# EAGLE design Impedance-Test-PCB (EAGLE 9.5.0)
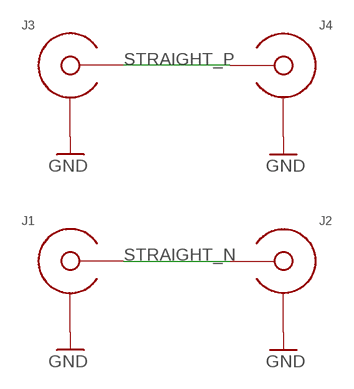
[diagram p0: schematic, sheet 1]

## Parts
J1  SMA-EDGE-LAUNCH4020N4  [SMA-EDGE-LAUNCH-4L-4020-N4]
J2  SMA-EDGE-LAUNCH4020N4  [SMA-EDGE-LAUNCH-4L-4020-N4]
J3  SMA-EDGE-LAUNCH4020N4  [SMA-EDGE-LAUNCH-4L-4020-N4]
J4  SMA-EDGE-LAUNCH4020N4  [SMA-EDGE-LAUNCH-4L-4020-N4]

## Nets
GND: J1.BOTTOM_GND(SHIELD) J1.GND@1(SHIELD) J1.GND@2(SHIELD) J1.GND@3(SHIELD) J1.GND@4(SHIELD) J1.GND@5(SHIELD) J1.GND@6(SHIELD) J1.GND@7(SHIELD) J1.GND@8(SHIELD) J1.GND@9(SHIELD) J1.GND@10(SHIELD) J1.GND@14(SHIELD) J1.GND@15(SHIELD) J1.GND@16(SHIELD) J1.GND@17(SHIELD) J1.GND_PAD1(SHIELD) J1.GND_PAD2(SHIELD) J1.P$1(SHIELD) J1.P$2(SHIELD) J1.P$3(SHIELD) J1.P$4(SHIELD) J1.P$5(SHIELD) J2.BOTTOM_GND(SHIELD) J2.GND@1(SHIELD) J2.GND@2(SHIELD) J2.GND@3(SHIELD) J2.GND@4(SHIELD) J2.GND@5(SHIELD) J2.GND@6(SHIELD) J2.GND@7(SHIELD) J2.GND@8(SHIELD) J2.GND@9(SHIELD) J2.GND@10(SHIELD) J2.GND@14(SHIELD) J2.GND@15(SHIELD) J2.GND@16(SHIELD) J2.GND@17(SHIELD) J2.GND_PAD1(SHIELD) J2.GND_PAD2(SHIELD) J2.P$1(SHIELD) J2.P$2(SHIELD) J2.P$3(SHIELD) J2.P$4(SHIELD) J2.P$5(SHIELD) J3.BOTTOM_GND(SHIELD) J3.GND@1(SHIELD) J3.GND@2(SHIELD) J3.GND@3(SHIELD) J3.GND@4(SHIELD) J3.GND@5(SHIELD) J3.GND@6(SHIELD) J3.GND@7(SHIELD) J3.GND@8(SHIELD) J3.GND@9(SHIELD) J3.GND@10(SHIELD) J3.GND@14(SHIELD) J3.GND@15(SHIELD) J3.GND@16(SHIELD) J3.GND@17(SHIELD) J3.GND_PAD1(SHIELD) J3.GND_PAD2(SHIELD) J3.P$1(SHIELD) J3.P$2(SHIELD) J3.P$3(SHIELD) J3.P$4(SHIELD) J3.P$5(SHIELD) J4.BOTTOM_GND(SHIELD) J4.GND@1(SHIELD) J4.GND@2(SHIELD) J4.GND@3(SHIELD) J4.GND@4(SHIELD) J4.GND@5(SHIELD) J4.GND@6(SHIELD) J4.GND@7(SHIELD) J4.GND@8(SHIELD) J4.GND@9(SHIELD) J4.GND@10(SHIELD) J4.GND@14(SHIELD) J4.GND@15(SHIELD) J4.GND@16(SHIELD) J4.GND@17(SHIELD) J4.GND_PAD1(SHIELD) J4.GND_PAD2(SHIELD) J4.P$1(SHIELD) J4.P$2(SHIELD) J4.P$3(SHIELD) J4.P$4(SHIELD) J4.P$5(SHIELD)
STRAIGHT_N: J1.CENTER@1(CENTER) J1.CENTER@2(CENTER) J2.CENTER@1(CENTER) J2.CENTER@2(CENTER)
STRAIGHT_P: J3.CENTER@1(CENTER) J3.CENTER@2(CENTER) J4.CENTER@1(CENTER) J4.CENTER@2(CENTER)

## Library data of the parts
J1-J4 = sma:SMA-EDGE-LAUNCH

## Board
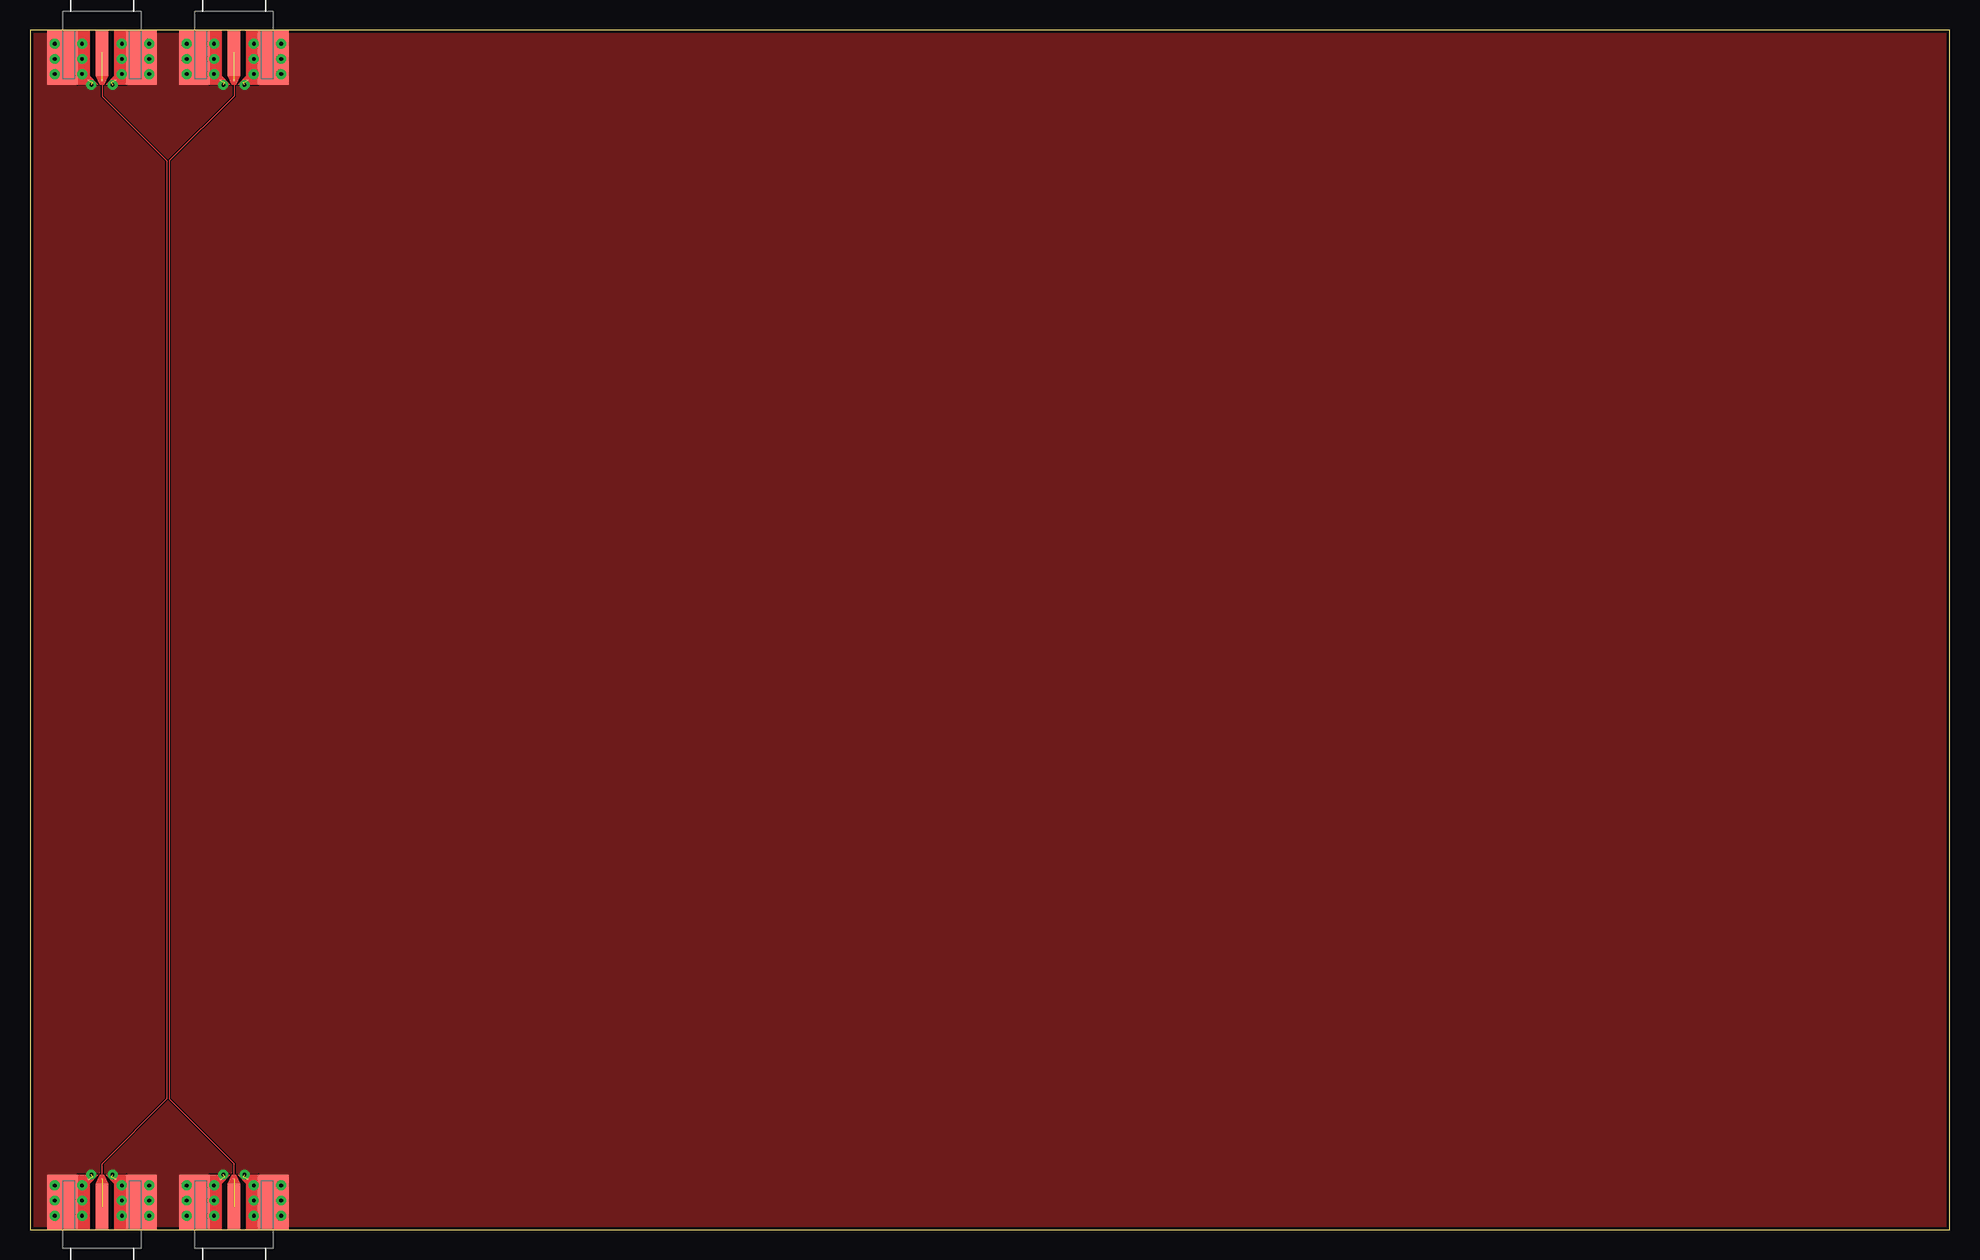
[diagram p1: board, top side]
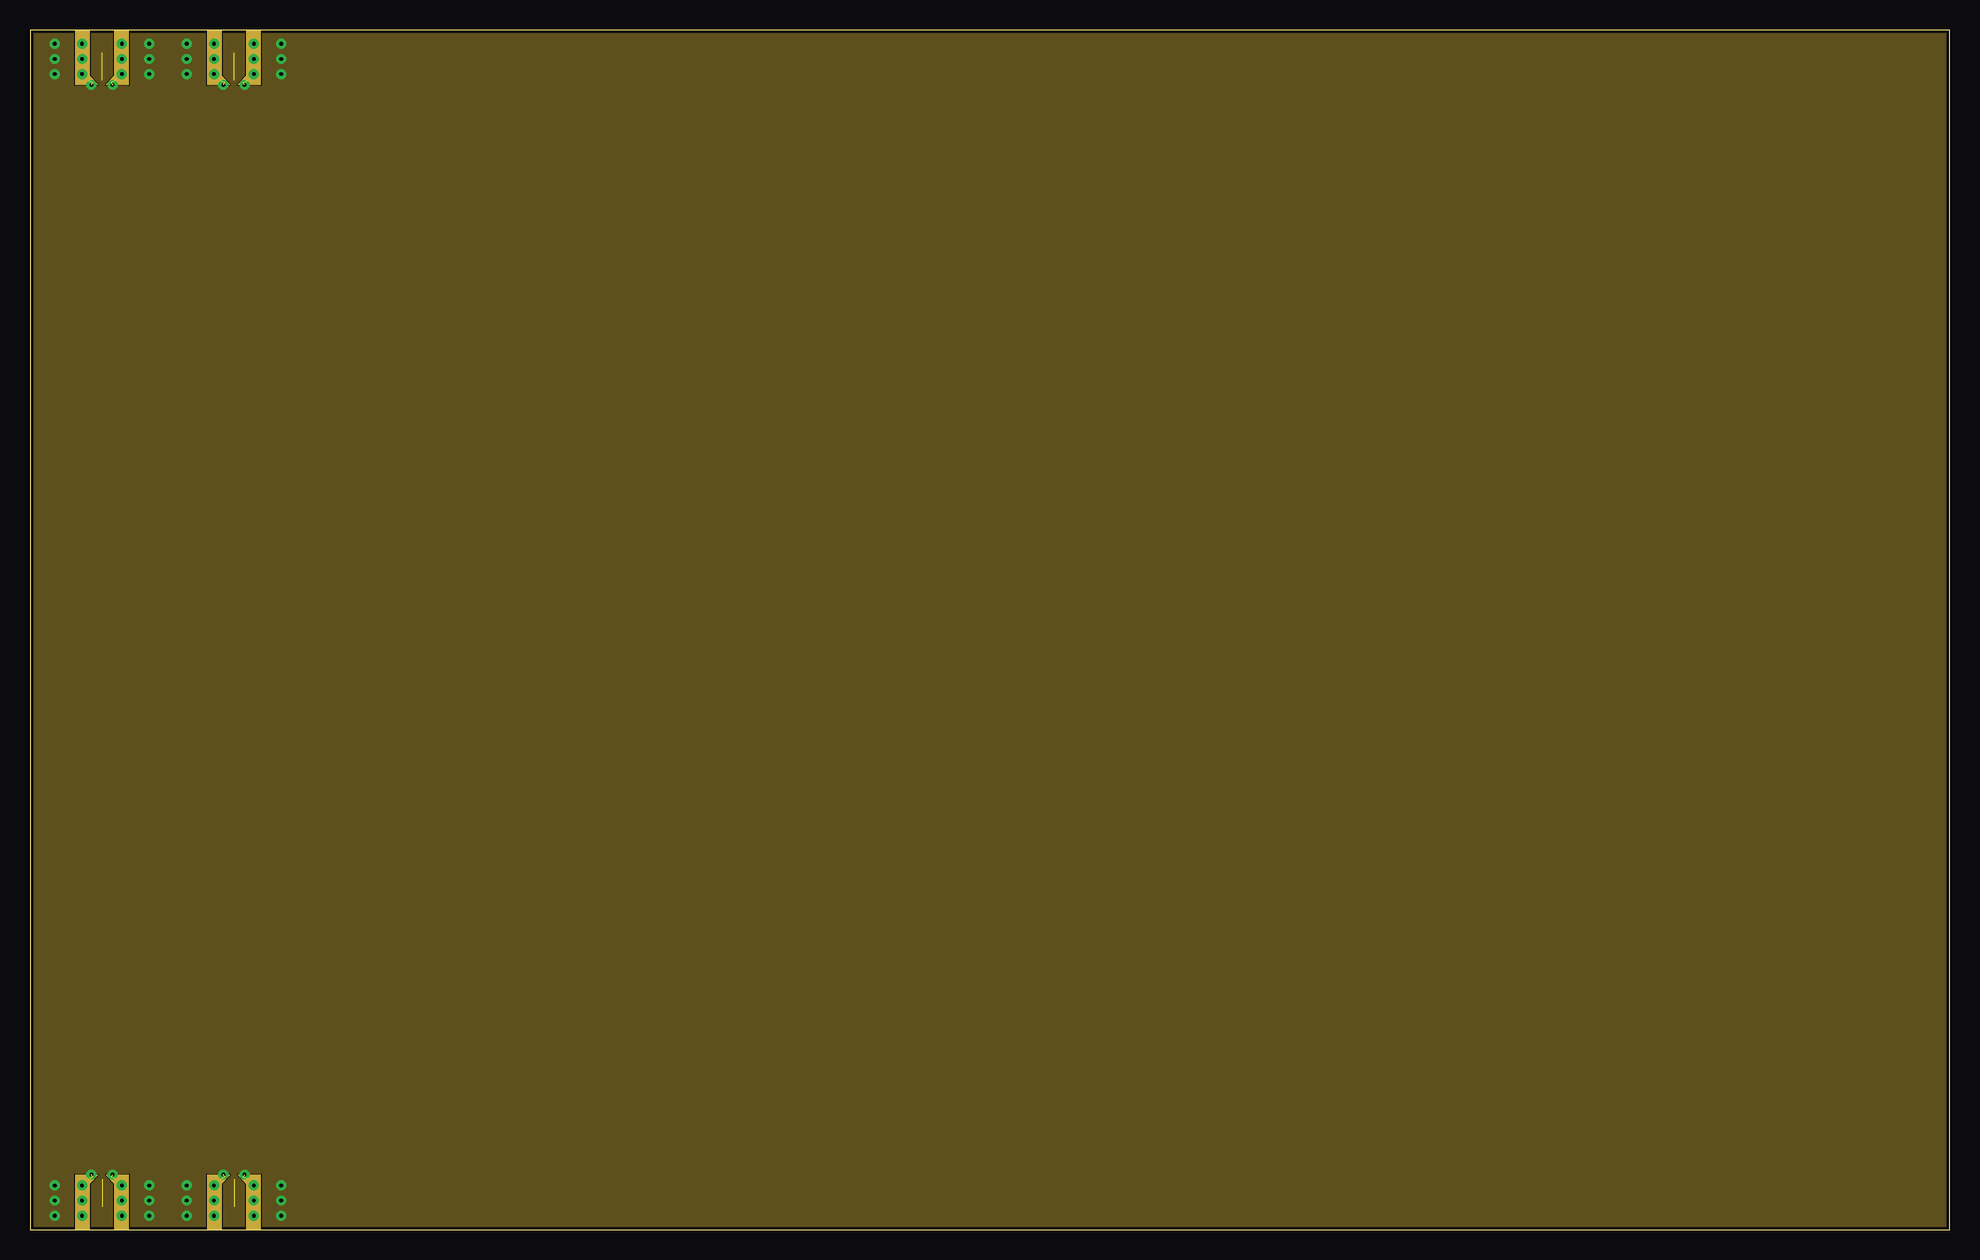
[diagram p2: board, inner layer Route2]
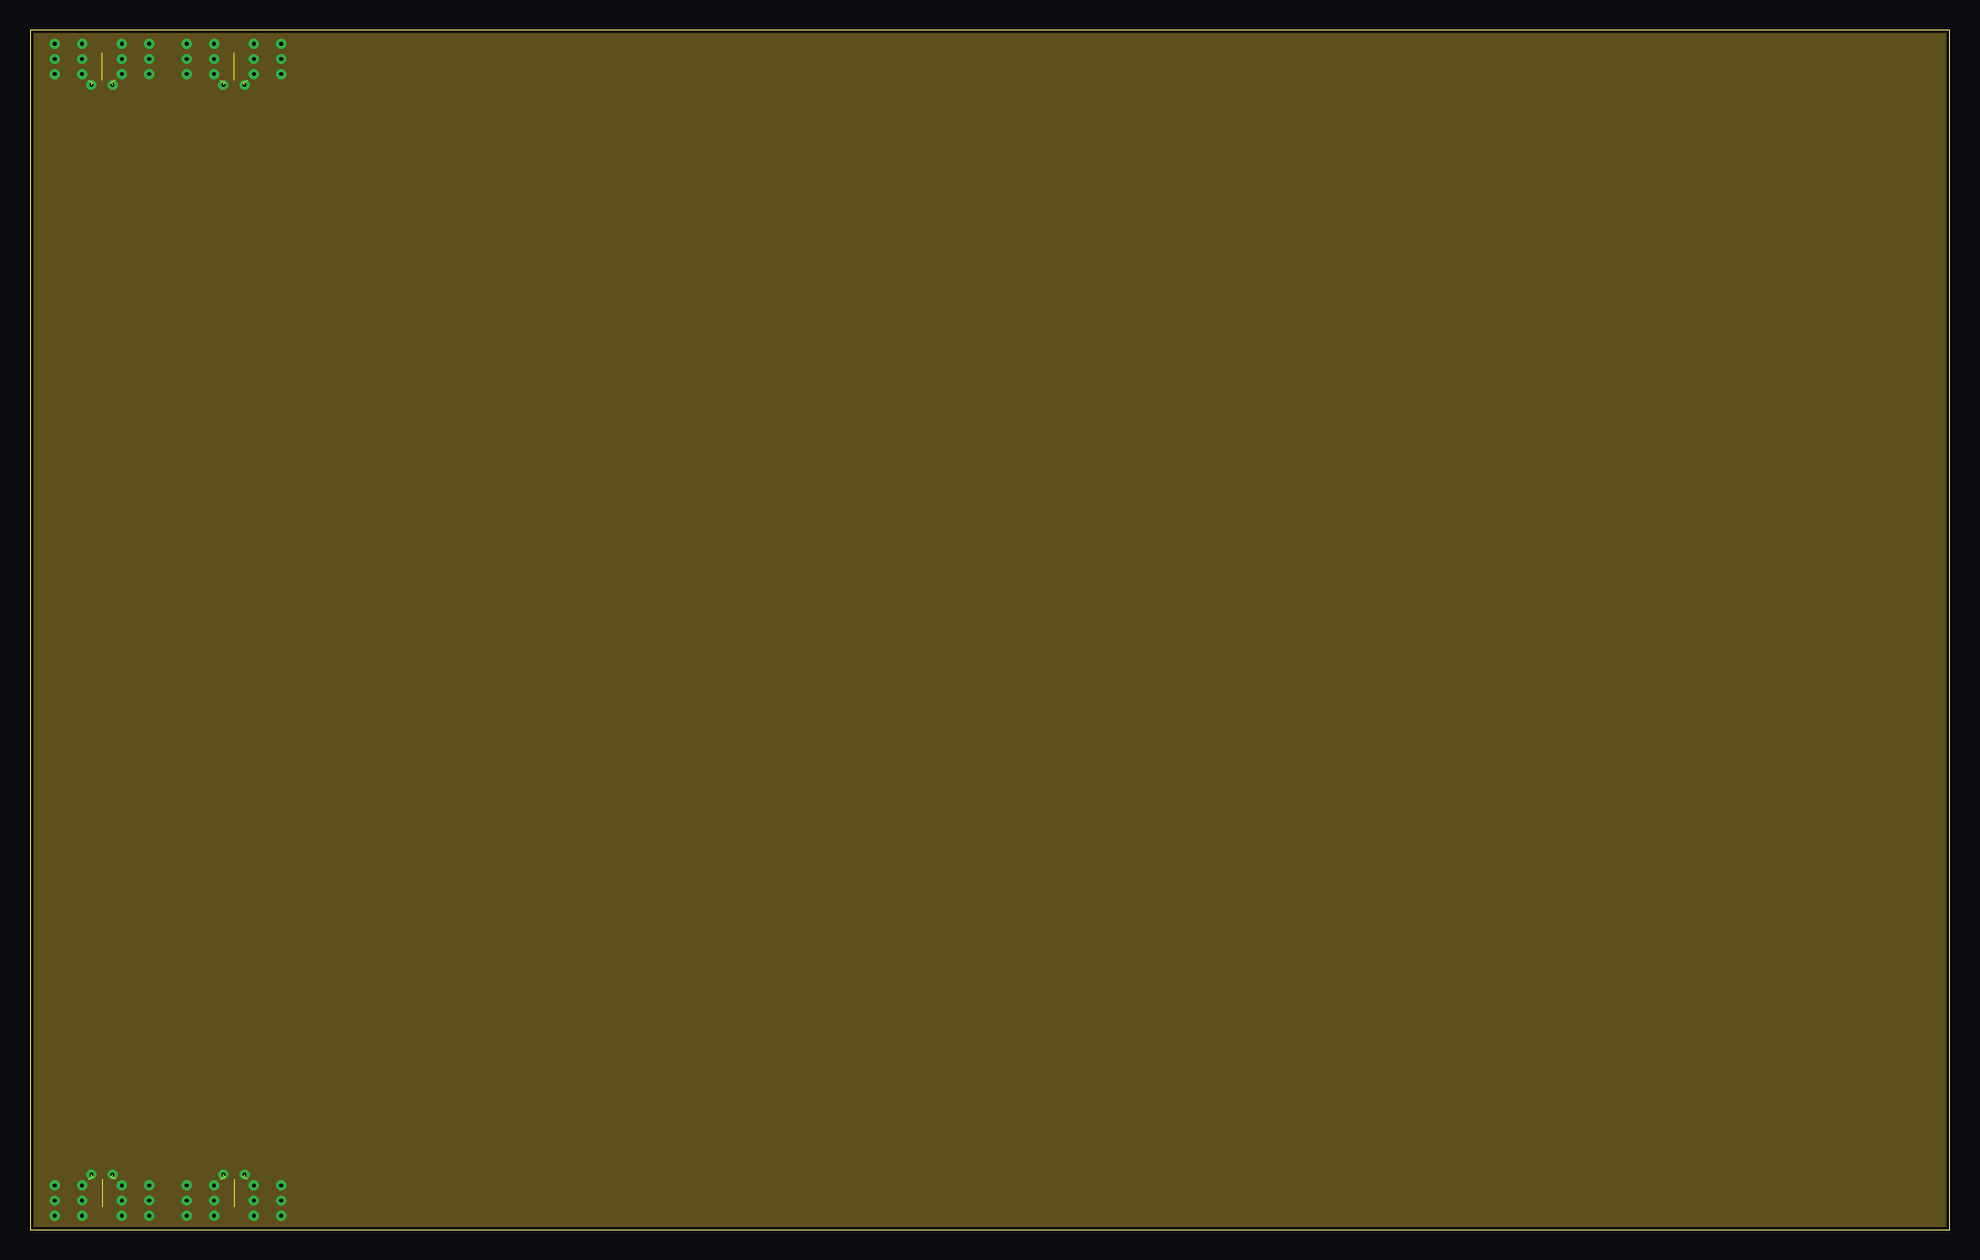
[diagram p3: board, inner layer Route15]
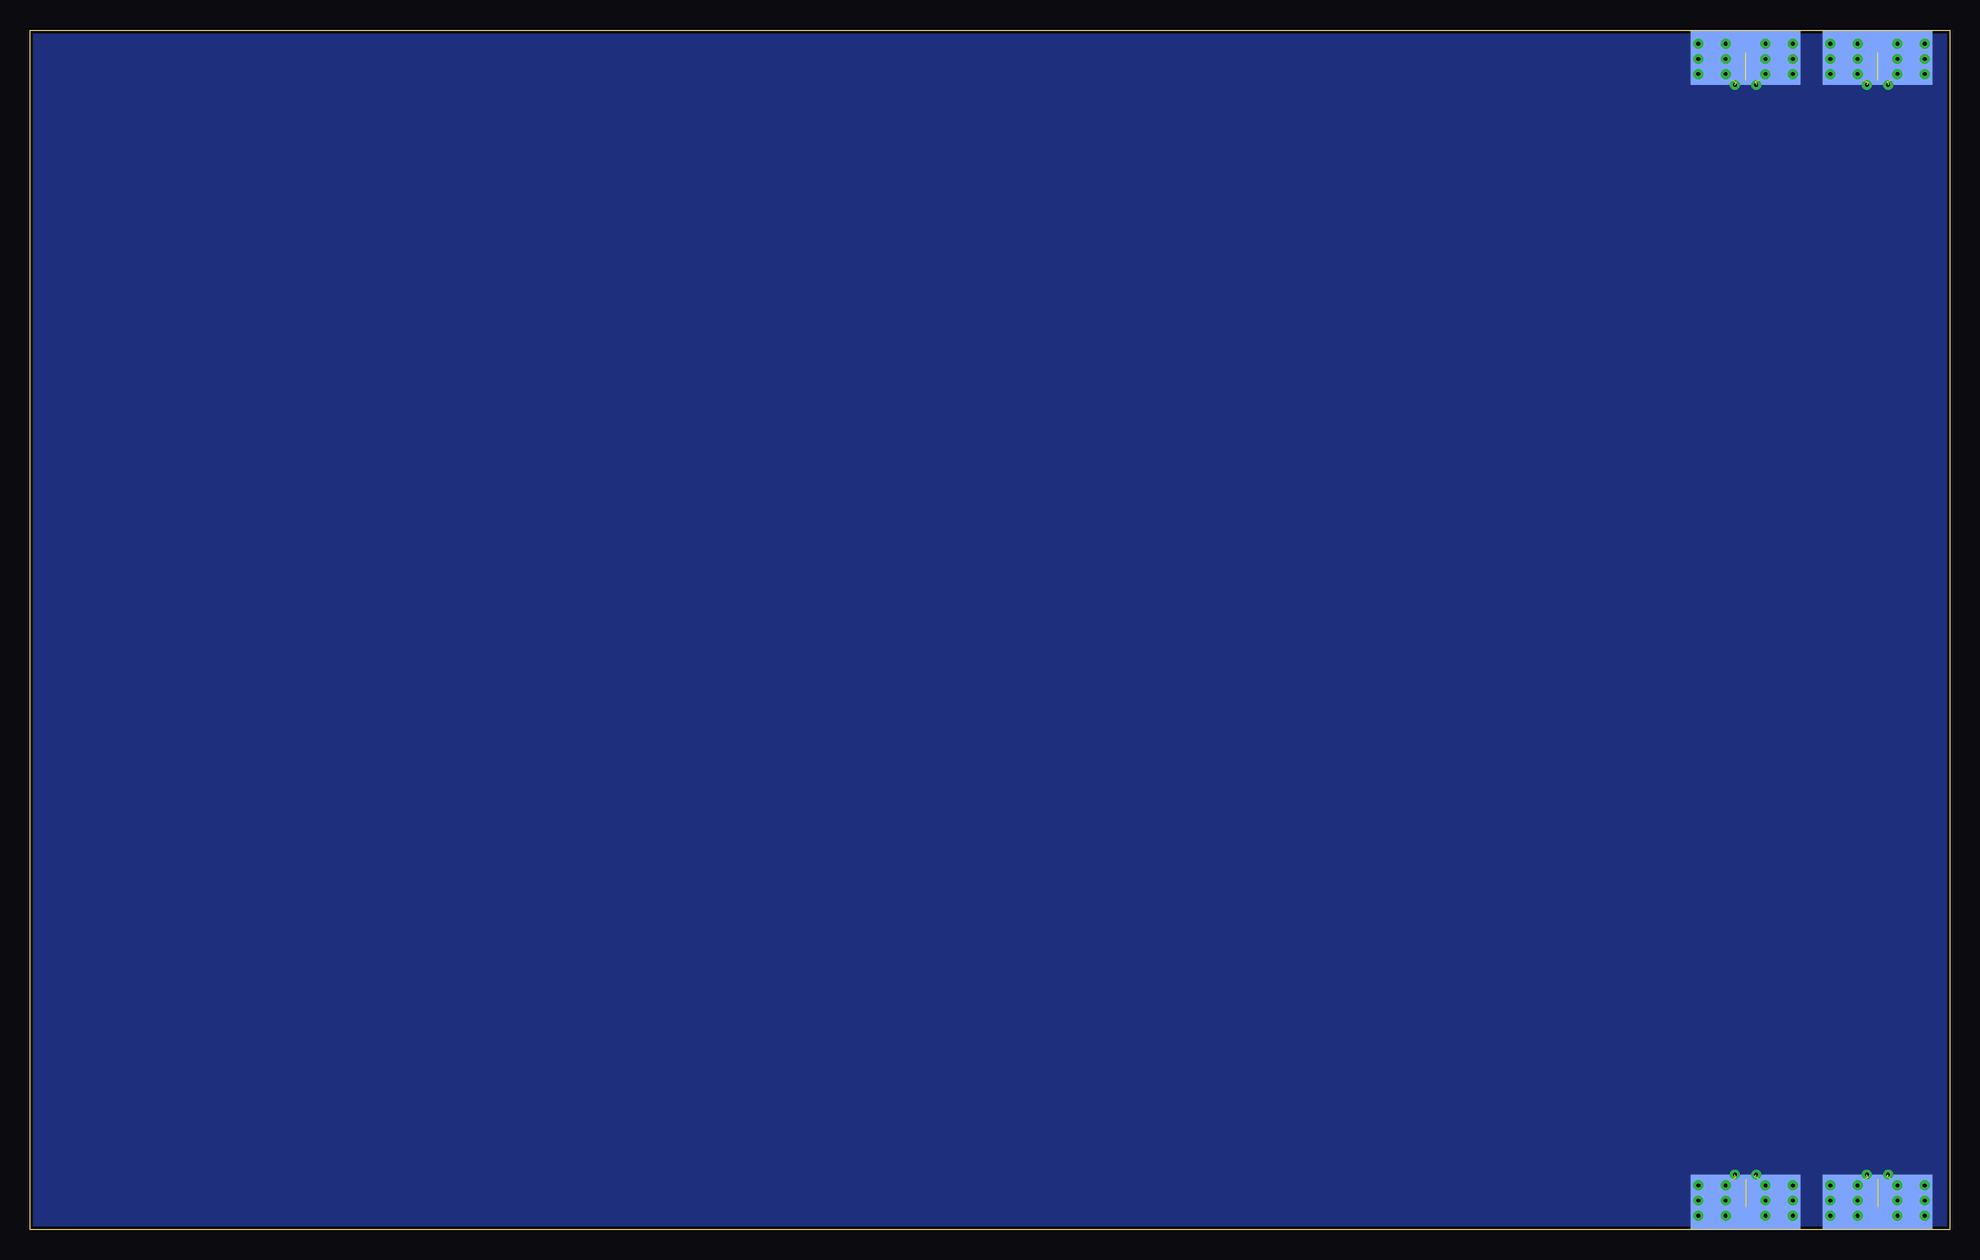
[diagram p4: board, bottom side, seen from below]

Size 160 x 100 mm. Coordinates in mm from the lower left corner, seen from the top.
Outline: 0,0 160,0 160,100 0,100 0,0
Copper layers (1+2*15+16): Top 0.035mm / dielectric 0.1mm / Route2 0.0175mm / dielectric 0.465mm / Route15 0.0175mm / dielectric 0.1mm / Bottom 0.035mm
Design rules "DLT-4.layer": minimum track width 3.5mil, minimum drill 0.2mm, track to track 3.5mil, track to pad 3.5mil, pad to pad 3.5mil, via to via 5mil, smd to smd 0mil, copper to edge 10mil, drill to drill 10mil, minimum pad ring 10mil, minimum via ring 0.125mm, stop-mask expansion 2mil, vias tented up to drill 100mil, thermal gap 10mil

### Footprints (pad centres in the part's own frame; a part is rotated, then mirrored left to right if it is on the bottom)
SMA-EDGE-LAUNCH-4L-4020-N4 = smd 4.572 x 9.144 bottom: BOTTOM_GND 2.286,0 | smd 3.81 x 1.016: CENTER@1 1.905,0 | smd 0.127 x 0.127: CENTER@2 4.191,0; P$1 4.191,1.143; P$2 4.191,-1.143; P$3 4.191,1.143; P$4 4.394,0.787; P$5 4.343,-0.813 | drill 0.3: GND@1 1.143,3.937; GND@2 3.683,3.937; GND@3 1.143,1.651; GND@4 3.683,1.651; GND@5 1.143,-1.651; GND@6 3.683,-1.651; GND@7 1.143,-3.937; GND@8 3.683,-3.937; GND@9 4.572,0.889; GND@10 4.572,-0.889; GND@14 2.413,3.937; GND@15 2.413,-3.937; GND@16 2.413,-1.651; GND@17 2.413,1.651 | smd 4.572 x 2.54: GND_PAD1 2.286,3.302; GND_PAD2 2.286,-3.302

### Placement (x,y rotation side)
J1  6,0 90 top
J2  6,100 270 top
J3  17,100 270 top
J4  17,0 90 top

### Tracks (layer width: path | path; a pad name or v marks a point on that pad's centre or on a via)
GND  (16 unrouted)
  pour Top: -4,104 164,104 164,-4 -4,-4
  pour Route2: -8,108 168,108 168,-8 -8,-8
  pour Route15: -12,112 172,112 172,-12 -12,-12
  pour Bottom: -16,116 176,116 176,-16 -16,-16
STRAIGHT_N  (2 unrouted)
  Top 0.102: J1.CENTER@1 6,5.5 11.4,10.9 11.4,89.09 6,94.5 J2.CENTER@2
STRAIGHT_P  (2 unrouted)
  Top 0.102: J4.CENTER@1 17,5.5 11.6,10.9 11.6,89.09 17,94.5 J3.CENTER@2